# EAGLE schematic L_B_block_base (EAGLE 9.6.2)
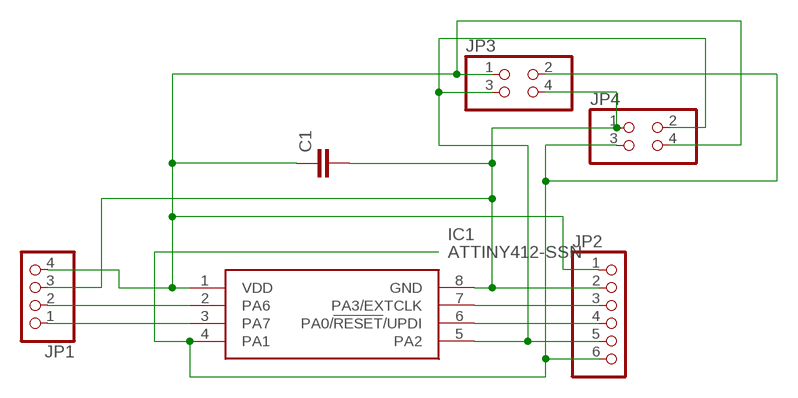
[diagram p0: schematic, sheet 1]

## Parts
C1  C-EUC0805K  [C0805K]
IC1  ATTINY412-SSN  [SOIC127P600X175-8N]
JP1  PINHD-1X4  [1X04]
JP2  PINHD-1X6  [1X06]
JP3  PINHD-2X2  [2X02]
JP4  PINHD-2X2  [2X02]

## Nets
GND: C1.2 IC1.8(GND) JP1.3 JP2.2 JP3.4 JP4.1
P0: IC1.2(PA6) JP1.2
P1: IC1.3(PA7) JP1.1
P4: IC1.7(PA3/EXTCLK) JP2.3
SCL: IC1.5(PA2) JP2.5 JP3.3 JP4.2
SDA: IC1.4(PA1) JP2.6 JP3.2 JP4.3
UPDI: IC1.6(PA0/!RESET!/UPDI) JP2.4
VDD: C1.1 IC1.1(VDD) JP1.4 JP2.1 JP3.1 JP4.4

## Library data of the parts
C1 = rcl:C-EU: CAPACITOR, European symbol; SPICEPREFIX: C
IC1 = ATTINY412-SSN:ATTINY412-SSN: 8-bit Microcontrollers - MCU 20MHz, 4KB, SOIC8, Ind 105C, Green, Tube Source: Datasheet <http://www.microchip.com/mymicrochip/filehandler.aspx?ddocname=en599382>; DESCRIPTION: 8-bit Microcontrollers - MCU 20MHz, 4KB, SOIC8, Ind 105C, Green, Tube; HEIGHT: 1.75mm; MANUFACTURER_NAME: Microchip; MANUFACTURER_PART_NUMBER: ATTINY412-SSN; MOUSER_PART_NUMBER: 579-ATTINY412-SSN; MOUSER_PRICE-STOCK: https://www.mouser.co.uk/ProductDetail/Microchip-Technology/ATTINY412-SSN?qs=3HJ2avRr9PItQG9ZsCamPQ%3D%3D
JP1 = pinhead2:PINHD-1X4: PIN HEADER
JP2 = pinhead2:PINHD-1X6: PIN HEADER
JP3 JP4 = pinhead2:PINHD-2X2: PIN HEADER